# EAGLE design 8mu_pub (EAGLE 9.3.1)
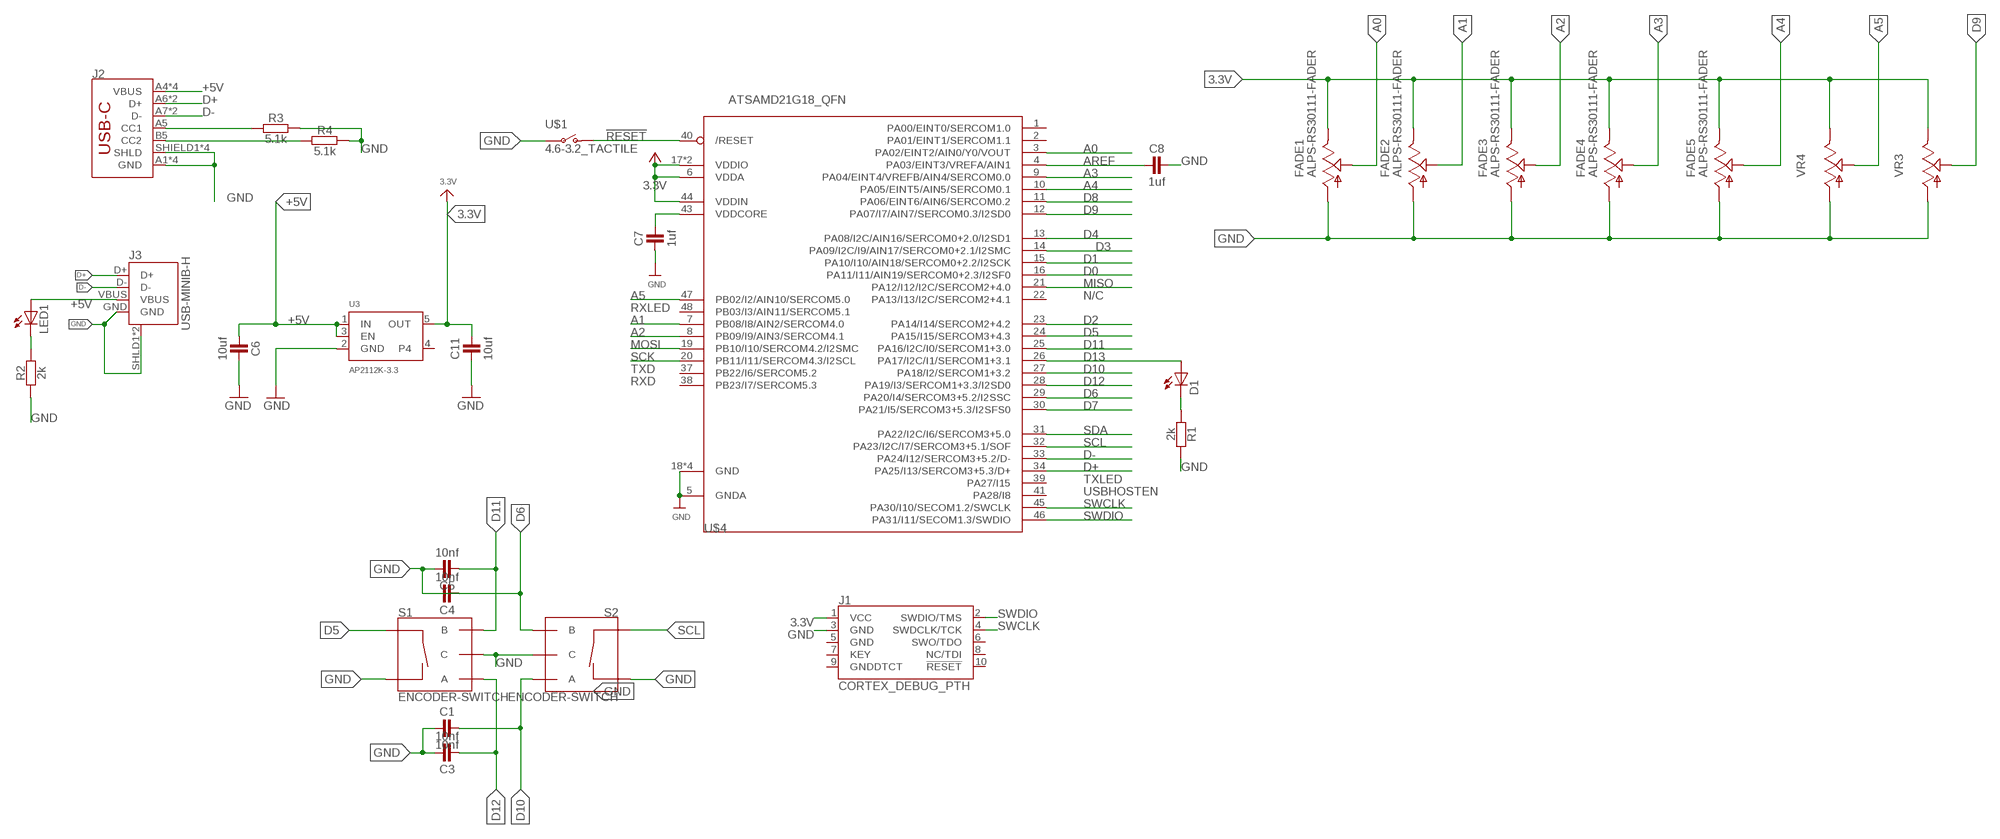
[diagram p0: schematic, sheet 1]

## Parts
C1  10nf  CAPACITOR-0603  [C0603]
C3  10nf  CAPACITOR-0603  [C0603]
C4  10nf  CAPACITOR-0603  [C0603]
C5  10nf  CAPACITOR-0603  [C0603]
C6  10uf  CAPACITOR-0603  [C0603]
C7  1uf  CAPACITOR-0603  [C0603]
C8  1uf  CAPACITOR-0603  [C0603]
C11  10uf  CAPACITOR-0603  [C0603]
D1  LED3MM  [LED3MM]
FADE1  ALPS-RS30111-FADER  [ALPS-RS30111-FADER]
FADE2  ALPS-RS30111-FADER  [ALPS-RS30111-FADER]
FADE3  ALPS-RS30111-FADER  [ALPS-RS30111-FADER]
FADE4  ALPS-RS30111-FADER  [ALPS-RS30111-FADER]
FADE5  ALPS-RS30111-FADER  [ALPS-RS30111-FADER]
J1  CORTEX_DEBUG_PTH  [2X5-PTH-1.27MM]
J2  USB_C  [CX90M-16P-USB-C-MIDMOUNT]
J3  USB-MINIB-H  [USB-MINIB-H]
LED1  LED3MM  [LED3MM]
R1  2k  RESISTOR-0603  [C0603]
R2  2k  RESISTOR-0603  [C0603]
R3  5.1k  RESISTOR-0603  [C0603]
R4  5.1k  RESISTOR-0603  [C0603]
S1  ENCODER-SWITCH  [ROTARY_ENC_PLAIN]
S2  ENCODER-SWITCH  [ROTARY_ENC_PLAIN]
U3  AP2112K-3.3  VREG_SOT23-5  [SOT23-5]
U$1  4.6-3.2_TACTILE  [TACTILE_SWITCH_SMD_4.6X2.8MM]
U$4  ATSAMD21G18_QFN  ATSAMD21J_QFN  [TQFN48_7MM]
VR3  9MM_SNAP-IN_POT_  [9MM_SNAP-IN_POT]
VR4  9MM_SNAP-IN_POT_  [9MM_SNAP-IN_POT]

## Nets
3.3V: C11.2 FADE1.3(E) FADE2.3(E) FADE3.3(E) FADE4.3(E) FADE5.3(E) J1.1(VCC) U3.5(OUT) U$4.6(VDDA) U$4.17(VDDIO) U$4.36(VDDIO) U$4.44(VDDIN) VR3.3(E) VR4.3(E) ; supply symbol labelled +3V3
!RESET: U$1.3(O) U$1.4(O) U$4.40(/RESET)
+5V: C6.1 J2.A4(VBUS) J2.A9(VBUS) J2.B4(VBUS) J2.B9(VBUS) J3.VBUS LED1.A U3.1(IN) U3.3(EN)
A0: FADE1.2(S) U$4.3(PA02/EINT2/AIN0/Y0/VOUT)
A1: FADE2.2(S) U$4.7(PB08/I8/AIN2/SERCOM4.0)
A2: FADE3.2(S) U$4.8(PB09/I9/AIN3/SERCOM4.1)
A3: FADE4.2(S) U$4.9(PA04/EINT4/VREFB/AIN4/SERCOM0.0)
A4: FADE5.2(S) U$4.10(PA05/EINT5/AIN5/SERCOM0.1)
A5: U$4.47(PB02/I2/AIN10/SERCOM5.0) VR4.2(S)
AREF: C8.1 U$4.4(PA03/EINT3/VREFA/AIN1)
D0: U$4.16(PA11/I11/AIN19/SERCOM0+2.3/I2SF0)
D1: U$4.15(PA10/I10/AIN18/SERCOM0+2.2/I2SCK)
D2: U$4.23(PA14/I14/SERCOM2+4.2)
D3: U$4.14(PA09/I2C/I9/AIN17/SERCOM0+2.1/I2SMC)
D4: U$4.13(PA08/I2C/AIN16/SERCOM0+2.0/I2SD1)
D5: S1.SW+ U$4.24(PA15/I15/SERCOM3+4.3)
D6: C4.2 S2.B U$4.29(PA20/I4/SERCOM3+5.2/I2SSC)
D7: U$4.30(PA21/I5/SERCOM3+5.3/I2SFS0)
D8: U$4.11(PA06/EINT6/AIN6/SERCOM0.2)
D9: U$4.12(PA07/I7/AIN7/SERCOM0.3/I2SD0) VR3.2(S)
D10: C1.2 S2.A U$4.27(PA18/I2/SERCOM1+3.2)
D11: C5.1 S1.B U$4.25(PA16/I2C/I0/SERCOM1+3.0)
D12: C3.1 S1.A U$4.28(PA19/I3/SERCOM1+3.3/I2SD0)
D13: D1.A U$4.26(PA17/I2C/I1/SERCOM1+3.1)
D+: J2.A6(D+) J2.B6(D+) J3.D+ U$4.34(PA25/I13/SERCOM3+5.3/D+)
D-: J2.A7(D-) J2.B7(D-) J3.D- U$4.33(PA24/I12/SERCOM3+5.2/D-)
GND: C1.1 C3.2 C4.1 C5.2 C6.2 C7.1 C8.2 C11.1 FADE1.1(A) FADE2.1(A) FADE3.1(A) FADE4.1(A) FADE5.1(A) J1.3(GND) J2.A1(GND) J2.A12(GND) J2.B1(GND) J2.B12(GND) J2.SHIELD1(SHLD) J2.SHIELD2(SHLD) J2.SHIELD3(SHLD) J2.SHIELD4(SHLD) J3.GND J3.SHLD1(SHIELD) J3.SHLD2(SHIELD) R1.2 R2.1 R3.2 R4.2 S1.C S1.SW- S2.C S2.SW- U3.2(GND) U$1.1(P) U$1.2(P) U$4.5(GNDA) U$4.18(GND) U$4.35(GND) U$4.42(GND) U$4.THERMAL(GND) VR3.1(A) VR4.1(A)
MISO: U$4.21(PA12/I12/I2C/SERCOM2+4.0)
MOSI: U$4.19(PB10/I10/SERCOM4.2/I2SMC)
N$1: D1.K(C) R1.1
N$2: LED1.K(C) R2.2
N$3: J2.A5(CC1) R3.1
N$4: J2.B5(CC2) R4.1
SCK: U$4.20(PB11/I11/SERCOM4.3/I2SCL)
SCL: S2.SW+ U$4.32(PA23/I2C/I7/SERCOM3+5.1/SOF)
SDA: U$4.31(PA22/I2C/I6/SERCOM3+5.0)
SWCLK: J1.4(SWDCLK/TCK) U$4.45(PA30/I10/SECOM1.2/SWCLK)
SWDIO: J1.2(SWDIO/TMS) U$4.46(PA31/I11/SECOM1.3/SWDIO)
VDDCORE: C7.2 U$4.43(VDDCORE)
Unconnected: J1.5(GND) J1.6(SWO/TDO) J1.7(KEY) J1.8(NC/TDI) J1.9(GNDDTCT) J1.10(!RESET) U3.4 U$4.1(PA00/EINT0/SERCOM1.0) U$4.2(PA01/EINT1/SERCOM1.1) U$4.22(PA13/I13/I2C/SERCOM2+4.1) U$4.37(PB22/I6/SERCOM5.2) U$4.38(PB23/I7/SERCOM5.3) U$4.39(PA27/I15) U$4.41(PA28/I8) U$4.48(PB03/I3/AIN11/SERCOM5.1)

## Notes on the sheet
- N/C
- RXLED
- TXD
- RXD
- TXLED
- USBHOSTEN

## Library data of the parts
C1 C3-C8 C11 = we-rcl:CAPACITOR: Capacitors ...2.2uF @ 6.3V -> 0402 ...4.7uF @ 6.3V -> 0603 ...10uF @ 16V -> 0805 ...22uF @ 25V -> 1206
D1 LED1 = TomW:LED: LED OSRAM: - CHIPLED LG R971, LG N971, LY N971, LG Q971, LY Q971, LO R971, LY R971 LH N974, LH R974 LS Q976, LO Q976, LY Q976 LO Q996 - Hyper CHIPLED LW Q18S LB Q993, LB Q99A, LB R99A - SideLED LS A670, LO A670, LY A670, LG A670, LP A670 LB A673, LV A673, LT A673, LW A673 LH A674 LY A675 LS A676, LA A676, LO A676, LY A676, LW A676 LS A679, LY A679, LG A679 - Hyper Micro SIDELED® LS Y876, LA Y876, LO Y876, LY Y876 LT Y87S - SmartLED LW L88C, LW L88S LB L89C, LB L89S, LG L890 LS L89K, LO L89K, LY L89K LS L896, LA L896, LO L896, LY L896 - TOPLED LS T670, LO T670, LY T670, LG T670, LP T670 LSG T670, LSP T670, LSY T670, LOP T670, LYG T670 LG T671, LOG T671, LSG T671 LB T673, LV T673, LT T673, LW T673 LH T674 LS T676, LA T676, LO T676, LY T676, LB T676, LH T676, LSB T676, LW T676 LB T67C, LV T67C, LT T67C, LS T67K, LO T67K, LY T67K, LW E67C LS E67B, LA E67B, LO E67B, LY E67B, LB E67C, LV E67C, LT E67C LW T67C LS T679, LY T679, LG T679 LS T770, LO T770, LY T770, LG T770, LP T770 LB T773, LV T773, LT T773, LW T773 LH T774 LS E675, LA E675, LY E675, LS T675 LS T776, LA T776, LO T776, LY T776, LB T776 LHGB T686 LT T68C, LB T68C - Hyper Mini TOPLED® LB M676 - Mini TOPLED Santana® LG M470 LS M47K, LO M47K, LY M47K Source: http://www.osram.convergy.de LUXEON: - LUMILED® LXK2-PW12-R00, LXK2-PW12-S00, LXK2-PW14-U00, LXK2-PW14-V00 LXK2-PM12-R00, LXK2-PM12-S00, LXK2-PM14-U00 LXK2-PE12-Q00, LXK2-PE12-R00, LXK2-PE12-S00, LXK2-PE14-T00, LXK2-PE14-U00 LXK2-PB12-K00, LXK2-PB12-L00, LXK2-PB12-M00, LXK2-PB14-N00, LXK2-PB14-P00, LXK2-PB14-Q00 LXK2-PR12-L00, LXK2-PR12-M00, LXK2-PR14-Q00, LXK2-PR14-R00 LXK2-PD12-Q00, LXK2-PD12-R00, LXK2-PD12-S00 LXK2-PH12-R00, LXK2-PH12-S00 LXK2-PL12-P00, LXK2-PL12-Q00, LXK2-PL12-R00 Source: www.luxeon.com KINGBRIGHT: KA-3528ASYC Source: www.kingbright.com
FADE1-FADE5 = MusicThingModular:ALPS-RS30111-FADER
J1 = SparkFun-Connectors:CORTEX_DEBUG: Cortex Debug Connector - 10 pin Supports JTAG debug, Serial Wire debug, and Serial Wire Viewer. PTH and SMD connector options available. General Connector Information <http://infocenter.arm.com/help/topic/com.arm.doc.faqs/attached/13634/cortex_debug_connectors.pdf> Products: PTH Connector <http://www.digikey.com/product-detail/en/cnc-tech/3220-10-0100-00/1175-1627-ND/3883661> -via Digi-Key SparkFun PSoc <https://www.sparkfun.com/products/13229> SparkFun T <https://www.sparkfun.com/products/13810>
J2 = MTM_untested:USB_C: USB Type C 16Pin Connector Super Speed pins not available on the 16-pin purely SMD connector so this part is best for USB 2.0 implementations. D1 and D2 are tied together enabling D+/- no matter which way the cable is plugged into the connector. The two channel configuration pins (CC1/2) are exposed. These are normally connected to ground via 5.1k resistors but can be reconfigured for high current/high power applications.
J3 = we-con:USB: USB Connectors
R1-R4 = we-rcl:RESISTOR: Resistors all kinds in 0402 and 0603
S1 S2 = SparkFun-Switches:ENCODER-SWITCH: Rotary Encoder w/ Select Switch Encoders rotate similarly to potentiometers, but they’re different from potentiometers in that an encoder has full rotation without limits. They output gray code so that you can tell how much and in which direction the encoder has been turned. This encoder includes a push-down select switch built into the shaft. SparkFun Products Rotary Encoder <https://www.sparkfun.com/products/9117> (COM-09117); SF_SKU: COM-09117
U3 = microbuilder:VREG_SOT23-5: SOT23-5 Fixed Voltage Regulators To better organise some of the SOT23-5 fixed voltage regulators in this library, this new part was created. Part Current Out V Out V In V Dropout Digikey Part No. ADP121 150mA 3.3V 3.4-5.5V 0.09V @ 150mA ADP121-AUJZ33R7CT-ND ADP121 150mA 3.0V 3.1-5.5V 0.09V @ 150mA ADP121-AUJZ30R7CT-ND ADP122 300mA 3.3V 3.4-5.5V 0.085V @ 300mA ADP122AUJZ-3.3-R7CT-ND ADP1712 300mA 3.3V 3.5-5.5V 0.17V @ 300mA ADP1712AUJZ-3.3-R7TR-ND AP7311 (Low Cost) 150mA 3.3V 3.5-6V 0.15V @ 150mA AP7311-33WG-7DICT-ND LD39015M18R 150mA 1.8V 1.9V-5.5V 0.08V @ 100mA 497-6977-1-ND MCP1824T-3302E/OT 300mA 3.3V 3.5V-6V 0.2V @ 300mA MCP1824T-3302E/OTCT-ND MIC5205-2.5YM5 TR 150mA 2.5V 2.7-16V 0.165V @ 150mA 576-1257-2-ND MIC5205-3.0YM5 TR 150mA 3.0V 3.2V-16V 0.165V @ 150mA 576-1258-2-ND MIC5205-3.3YM5 TR 150mA 3.3V 3.5V-16V 0.165V @ 150mA 576-1259-2-ND TPS780330220 150mA 3.3V+2.2V 3.6-5.5V 250mV Max 296-23332-1-ND TDA3663/N1,135 100mA 3.3V 3.5-45V 0.18V @ 50mA 568-5343-1-ND
U$1 = MTM_untested:4.6-3.2_TACTILE
U$4 = microbuilder:ATSAMD21J
VR3 VR4 = MusicThingModular:9MM_SNAP-IN_POT: 9mm vertical snap-in pot, Alpha / Panasonic style

## Net classes
3 pair: width 0.254 mm

## Board
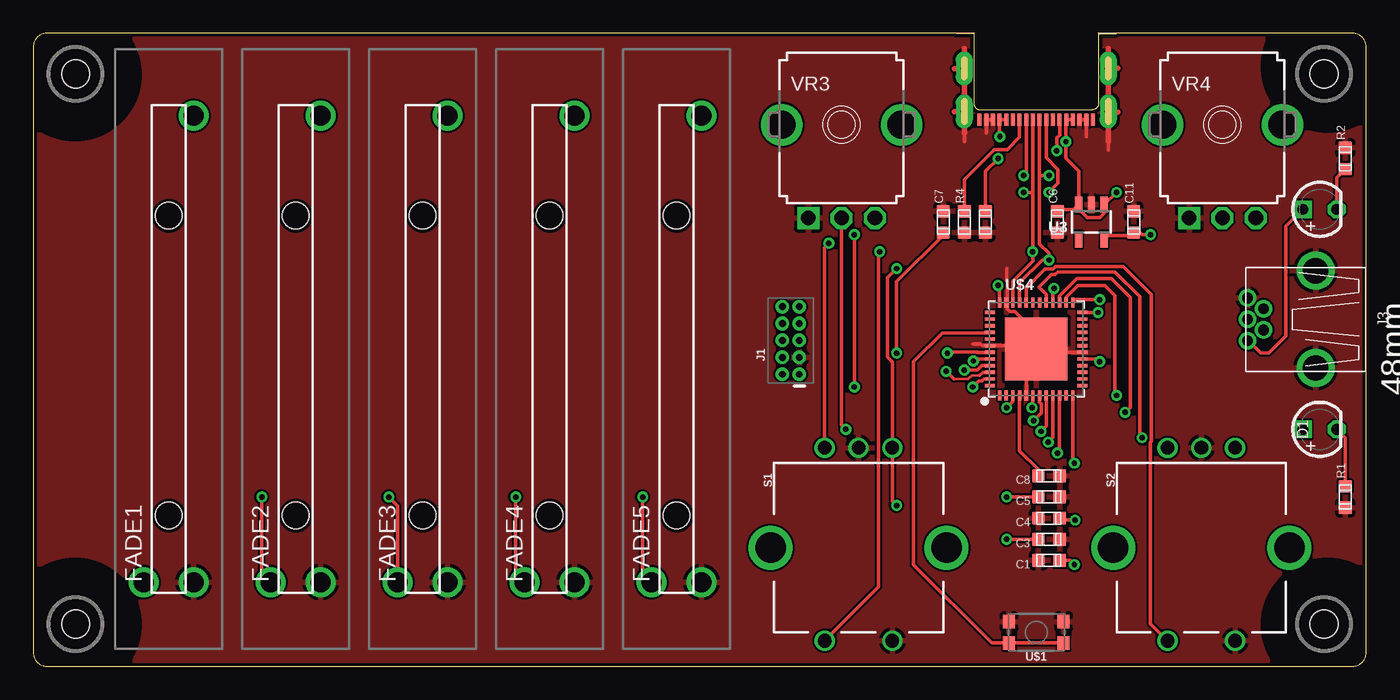
[diagram p1: board, top side]
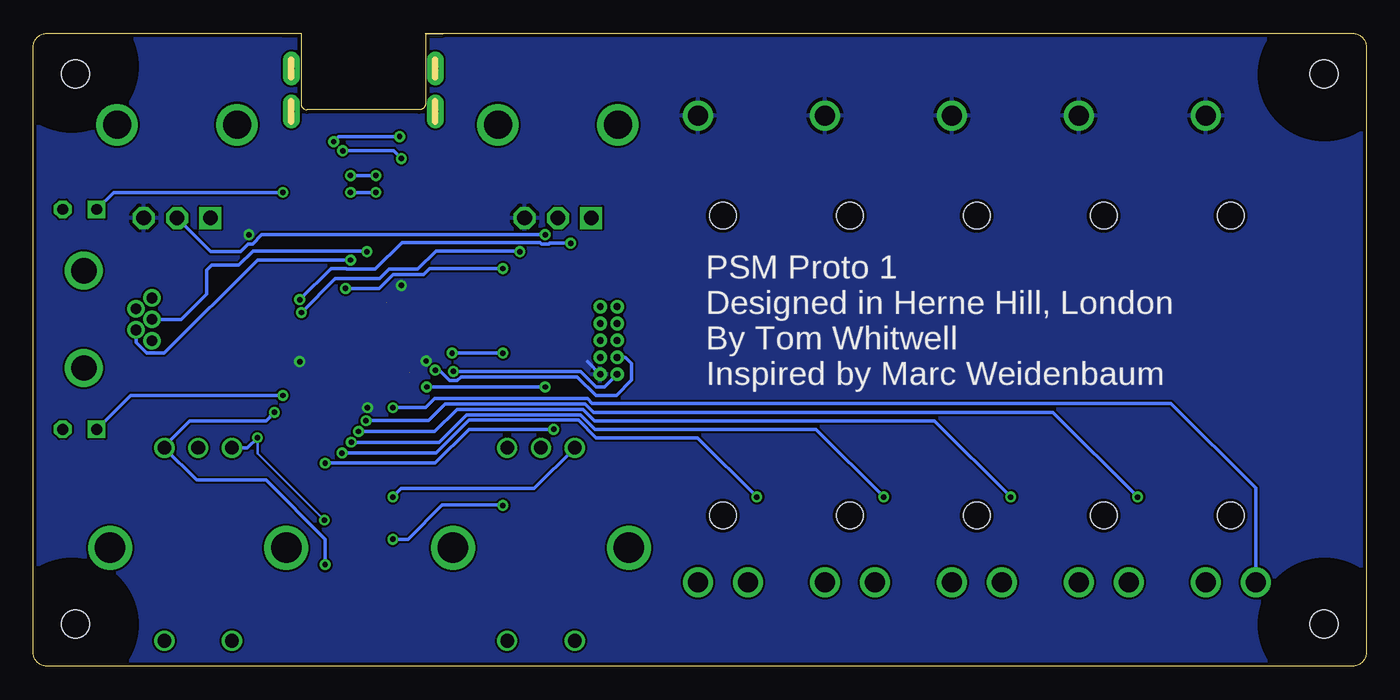
[diagram p2: board, bottom side, seen from below]

Size 100 x 47.5 mm. Coordinates in mm from the lower left corner, seen from the top.
Outline: 79.88,47.5 99,47.5 arc-90 100,46.5 100,1 arc-90 99,0 1,0 arc-90 0,1 0,46.5 arc-90 1,47.5 70.61,47.5
Copper layers (1*16): Top 0.035mm / dielectric 1.5mm / Bottom 0.035mm
Design rules "adafruit *": minimum track width 8mil, minimum drill 15.5mil, track to track 6mil, track to pad 6mil, pad to pad 6mil, via to via 6mil, smd to smd 6mil, copper to edge 10mil, drill to drill 8mil, minimum pad ring 10mil, minimum via ring 8mil, stop-mask expansion 2mil, vias tented up to drill 20mil, thermal gap 10mil
Holes 2.1 mm at 3.17,44.45 3.17,3.17 96.84,44.45 96.84,3.17
tRestrict: area -1.9,-1.9 to 8.1,8.1; area -1.9,39.4 to 8.1,49.4; area 92.1,40 to 102.1,50; area 92.1,-1.9 to 102.1,8.1
bRestrict: area -1.9,39.4 to 8.1,49.4; area -1.9,-1.9 to 8.1,8.1; area 92.1,40 to 102.1,50; area 92.1,-1.9 to 102.1,8.1

### Footprints (pad centres in the part's own frame; a part is rotated, then mirrored left to right if it is on the bottom)
C0603 = smd 1 x 0.95: 1 0,0.8; 2 0,-0.8
LED3MM = drill 0.813 square: A -1.27,0 | drill 0.813 octagon: K 1.27,0
ALPS-RS30111-FADER = drill 1.5: 1 -17.5,-1.875; 2 -17.5,1.875; 3 17.5,-1.875 | hole 2: -12.5,0; 10,0
2X5-PTH-1.27MM = drill 0.508 pad 1: 1 -2.54,-0.635; 2 -2.54,0.635; 3 -1.27,-0.635; 4 -1.27,0.635; 5 0,-0.635; 6 0,0.635; 7 1.27,-0.635; 8 1.27,0.635; 9 2.54,-0.635; 10 2.54,0.635
CX90M-16P-USB-C-MIDMOUNT = smd 0.3 x 0.9: A1 -3.75,3.85; A4 -2.75,3.85; A5 -1.75,3.85; A6 -0.75,3.85; A7 0.75,3.85; A8 1.75,3.85; A9 2.75,3.85; A12 3.75,3.85; B1 3.25,3.85; B4 2.25,3.85; B5 1.25,3.85; B6 0.25,3.85; B7 -0.25,3.85; B8 -1.25,3.85; B9 -2.25,3.85; B12 -3.25,3.85; MID1 -4.25,3.85; MID2 4.25,3.85 | drill 0.5 pad 1.27 long: SHIELD1 -5.4,0; SHIELD2 5.4,0; SHIELD3 -5.4,3.23; SHIELD4 5.4,3.23
USB-MINIB-H = drill 0.8 pad 1.25: D+ -5.1,0; D- -3.9,-0.8; GND -5.1,1.6; ID -3.9,0.8; VBUS -5.1,-1.6 | drill 1.9: SHLD1 0,-3.65; SHLD2 0,3.65
ROTARY_ENC_PLAIN = drill 1.016: A 7.493,-2.54; B 7.493,2.54; C 7.493,0; SW+ -6.985,2.54; SW- -6.985,-2.54 | drill 2.286: P$3 0,6.604; P$4 0,-6.604
SOT23-5 = smd 0.55 x 1.2: 1 -0.95,-1.3; 2 0,-1.3; 3 0.95,-1.3; 4 0.95,1.3; 5 -0.95,1.3
TACTILE_SWITCH_SMD_4.6X2.8MM = smd 0.9 x 1: 1 -2.05,-0.8; 2 2.05,-0.8; 3 2.05,0.8; 4 -2.05,0.8
TQFN48_7MM = smd 0.25 x 0.75: 1 -2.75,-3.475; 2 -2.25,-3.475; 3 -1.75,-3.475; 4 -1.25,-3.475; 5 -0.75,-3.475; 6 -0.25,-3.475; 7 0.25,-3.475; 8 0.75,-3.475; 9 1.25,-3.475; 10 1.75,-3.475; 11 2.25,-3.475; 12 2.75,-3.475; 25 2.75,3.475; 26 2.25,3.475; 27 1.75,3.475; 28 1.25,3.475; 29 0.75,3.475; 30 0.25,3.475; 31 -0.25,3.475; 32 -0.75,3.475; 33 -1.25,3.475; 34 -1.75,3.475; 35 -2.25,3.475; 36 -2.75,3.475 | smd 0.75 x 0.25: 13 3.475,-2.75; 14 3.475,-2.25; 15 3.475,-1.75; 16 3.475,-1.25; 17 3.475,-0.75; 18 3.475,-0.25; 19 3.475,0.25; 20 3.475,0.75; 21 3.475,1.25; 22 3.475,1.75; 23 3.475,2.25; 24 3.475,2.75; 37 -3.475,2.75; 38 -3.475,2.25; 39 -3.475,1.75; 40 -3.475,1.25; 41 -3.475,0.75; 42 -3.475,0.25; 43 -3.475,-0.25; 44 -3.475,-0.75; 45 -3.475,-1.25; 46 -3.475,-1.75; 47 -3.475,-2.25; 48 -3.475,-2.75 | smd 4.7 x 4.7: THERMAL 0,0
9MM_SNAP-IN_POT = drill 1.1 square: 1 -2.5,-7 | drill 1.1 octagon: 2 0,-7; 3 2.5,-7 | drill 2.1 pad 2.794: CHASSIS1 -4.5,0; CHASSIS2 4.5,0

### Placement (x,y rotation side)
C1  76.2,7.94 90 top
C3  76.2,9.53 90 top
C4  76.2,11.11 90 top
C5  76.2,12.7 90 top
C6  76.83,33.34 0 top
C7  68.26,33.34 0 top
C8  76.2,14.29 90 top
C11  82.55,33.34 0 top
D1  96.52,17.78 0 top
FADE1  10.16,23.81 90 top
FADE2  19.68,23.81 90 top
FADE3  29.21,23.81 90 top
FADE4  38.73,23.81 90 top
FADE5  48.26,23.81 90 top
J1  56.83,24.45 90 top
J2  75.25,44.87 180 top
J3  96.2,26.04 0 top
LED1  96.52,34.29 0 top
R1  98.42,12.7 0 top
R2  98.42,38.1 0 top
R3  71.44,33.34 0 top
R4  69.85,33.34 0 top
S1  61.91,8.89 90 top
S2  87.63,8.89 90 top
U3  79.38,33.34 180 top
U$1  75.25,2.54 180 top
U$4  75.25,23.81 0 top
VR3  60.64,40.64 0 top
VR4  89.22,40.64 0 top

### Tracks (layer width: path | path; a pad name or v marks a point on that pad's centre or on a via)
3.3V  (via drill 0.41)
  Top 0.254: U3.5 80.6,32.32 82.33,32.32 C11.2 83.03,32.54 83.19,32.38 v83.82,32.38 | U$4.36 72.5,28.47 v72.39,28.57 | U$4.17 79.81,23.06 v80.01,22.86 | U$4.6 75.01,19.47 v74.93,19.4 | U$4.44 70.69,23.06 v70.53,22.91
  Bottom 0.254: J1.1 58.42,22.86
  pour Bottom: -1.59,52.39 103.19,52.39 103.19,-1.59 -1.59,-1.59
!RESET
  Top 0.254: U$1.4 U$1.3 71.92,1.74 66.04,7.62 66.04,22.86 68.2,25.02 71.73,25.02 U$4.40
+5V  (via drill 0.41)
  Top 0.254: J2.A4 J2.B9 77.47,40.89 v77.47,39.37 77.47,38.98 77.47,38.97 77.47,38.12 78.44,37.16 78.42,37.15 U3.3 | J2.B4 J2.A9 72.5,39.77 v72.52,39.75 | U3.3 78.44,34.62 78.44,34.3 79.09,33.66 80.01,33.66 80.33,33.97 U3.1 81.25,35.56 v81.28,35.56 | C6.1 76.95,34.26 78.04,34.26 U3.3 | J3.VBUS 91.14,24.43 92.08,23.5 92.71,23.5 93.98,24.77 93.98,33.02 LED1.A
  Bottom 0.254: v72.52,39.75 77.09,39.75 v77.47,39.37 | v81.28,35.56 93.98,35.56 LED1.A
A0  (via drill 0.41)
  Top 0.254: U$4.3 73.5,19.88 v73.03,19.4
  Bottom 0.254: v73.03,19.4 70.59,19.4 69.9,20.09 58.43,20.09 58.07,19.73 48.85,19.73 48.84,19.74 14.66,19.74 8.29,13.37 FADE1.2
A1  (via drill 0.41)
  Top 0.254: v17.14,12.7 17.14,6.98 FADE2.2 | U$4.7 75.5,19.8 75.62,19.68 75.62,19 v75.04,18.43
  Bottom 0.254: v75.04,18.43 70.35,18.43 69.09,19.68 58.6,19.68 57.97,19.05 23.5,19.05 v17.14,12.7
A2  (via drill 0.41)
  Top 0.254: v26.67,12.7 27.34,12.04 FADE3.2 | U$4.8 76,19.87 76.02,19.85 76.02,18.05 v75.6,17.62
  Bottom 0.254: v75.6,17.62 69.88,17.62 68.22,19.28 58.77,19.28 57.91,18.41 32.38,18.41 v26.67,12.7
A3  (via drill 0.41)
  Top 0.254: U$4.9 76.5,17.16 v76.15,16.81 | v36.2,12.7 36.2,6.98 FADE4.2
  Bottom 0.254: v36.2,12.7 41.27,17.78 57.84,17.78 58.94,18.87 67.49,18.87 69.55,16.81 v76.15,16.81
A4  (via drill 0.41)
  Top 0.254: U$4.10 77,16 v76.83,16 | v45.72,12.7 45.72,6.98 FADE5.2
  Bottom 0.254: v76.83,16 69.79,16 67.32,18.47 59.11,18.47 57.78,17.14 50.16,17.14 v45.72,12.7
A5  (via drill 0.41)
  Top 0.254: U$4.47 71.31,21.56 71.15,21.41 70.94,21.41 v70.48,20.95 | v61.59,20.95 v61.59,32.38
  Bottom 0.254: v70.48,20.95 v61.59,20.95 | v61.59,32.38 82.85,32.38 83.54,31.7 83.87,31.7 84.45,31.11 86.69,31.11 VR4.2
AREF
  Top 0.254: U$4.4 74,16.17 75.4,14.77 C8.1
D5  (via drill 0.41)
  Top 0.254: v63.5,31.11 63.41,31.03 63.41,5.94 S1.SW+ | v79.88,26.54 79.86,26.56 U$4.24
  Bottom 0.254: v63.5,31.11 63.55,31.17 69.8,31.17 71.17,29.79 73.31,29.79 74.02,29.08 77.34,29.08 v79.88,26.54
D6  (via drill 0.39, 0.41)
  Top 0.203: 77.14,10.97 C4.2 | 78.11,10.97 v78.17,10.97
  Top 0.254: U$4.29 76,27.89 75.44,28.45 76.38,29.39 76.65,29.39 76.86,29.59 81.15,29.59 83.01,27.74 83.01,17.32 v83.19,17.14 | 77.14,10.97 78.11,10.97
  Bottom 0.203: v78.17,10.97 83.19,15.98 v83.19,17.14
  Bottom 0.254: v83.19,17.14 83.95,16.38 S2.B
D9  (via drill 0.41)
  Top 0.254: VR3.2 60.64,18.1 v60.96,17.78 | v78.11,15.24 78,15.35 U$4.12
  Bottom 0.254: v78.11,15.24 69.85,15.24 67.31,17.78 v60.96,17.78
D10  (via drill 0.41)
  Top 0.254: C1.2 77.79,7.94 v78.11,7.62 | U$4.27 77,27.8 78.29,29.08 80.9,29.08 82.3,27.69 82.3,19.43 v81.92,19.05
  Bottom 0.254: v78.11,7.62 78.11,9.53 82.55,13.97 87.76,13.97 S2.A 90.17,16.51 88.27,18.41 82.55,18.41 v81.92,19.05
D11  (via drill 0.41)
  Top 0.254: U$4.25 78.22,27.51 v80.01,27.51 | v59.69,31.75 59.37,31.43 S1.B | v73.03,12.7 C5.1
  Bottom 0.254: S1.B 62.42,13.34 72.39,13.34 v73.03,12.7 | v80.01,27.51 77.67,29.84 76.53,29.84 76.48,29.79 74.35,29.79 72.34,31.8 61.98,31.8 61.88,31.7 61.31,31.7 61.26,31.75 v59.69,31.75
D12  (via drill 0.41)
  Top 0.254: v64.77,12.06 64.45,12.38 S1.A 64.45,22.84 64.08,23.21 64.08,29.16 v64.77,29.84 | v73.03,9.53 C3.1 | v76.58,28.35 76.5,28.27 U$4.28
  Bottom 0.254: v73.03,9.53 71.88,9.53 69.32,12.09 64.8,12.09 v64.77,12.06 | v64.77,29.84 70.26,29.84 70.72,29.39 73,29.39 74.04,28.35 v76.58,28.35
D13  (via drill 0.41)
  Top 0.254: U$4.26 77.5,27.72 78.35,28.57 80.39,28.57 81.15,27.81 81.15,20.32 v81.28,20.32
  Bottom 0.254: v81.28,20.32 92.71,20.32 D1.A
D+  (via drill 0.41)  (1 unrouted)
  Top 0.254: J2.B6 75.01,40.91 75.01,35.56 74.98,35.56 | 74.98,35.56 v74.98,31.11 74.98,30.4 73.5,28.92 73.5,27.36 U$4.34 | J2.A6 76,38.17 76.89,37.29 76.89,36.25 v76.2,35.56 | v74.3,35.56 74.98,35.56
  Bottom 0.254: v76.2,35.56 v74.3,35.56 | J3.D+ 88.9,26.04 87,27.94 87,29.72 86.61,30.1 84.58,30.1 83.52,31.17 75.03,31.17 v74.98,31.11
D-  (via drill 0.41)
  Top 0.254: J2.B7 75.5,36.83 | 75.5,36.83 75.5,31.7 76.2,30.99 v76.2,30.48 75.69,30.48 74,28.79 U$4.33 | v74.3,36.83 74.3,36.84 74.5,37.05 74.5,40.91 J2.A7 | v76.2,36.83 75.5,36.83
  Bottom 0.254: J3.D- 92.29,24.3 91.49,23.5 90.16,23.5 83.19,30.48 v76.2,30.48 | v74.3,36.83 v76.2,36.83
GND
  Top 0.254: 78.99,39.75 79,39.76 J2.A1 J2.B12 | 71.5,40.01 J2.A12 J2.B1 | 73.03,29.84 73.03,28.91 73.08,28.86 73.08,27.37 U$4.35 73.09,27.19 73.09,26.8 73.26,26.63 73.65,26.63 74.93,25.36 74.93,23.5 | 70.48,24.18 71.07,24.18 71.19,24.06 U$4.42 74.36,24.06 74.93,23.5 | U$4.5 74.5,23.06 74.93,23.5 | 74.93,23.5 U$4.THERMAL 75.5,23.56 U$4.18 | J2.SHIELD2 J2.SHIELD4 69.85,41.53 69.85,40.01 69.85,39.37 | J2.SHIELD1 J2.SHIELD3 80.64,41.53 80.64,39.37 80.64,38.73
  Top 0.406: 80.64,46.35 80.64,39.37 | 69.85,46.35 69.85,40.01
  pour Top: -3.17,49.21 -3.17,-1.59 104.78,-1.59 104.78,49.21
N$1
  Top 0.254: R1.1 98.42,17.14 D1.K
N$2
  Top 0.254: LED1.K 97.79,36.66 R2.2
N$3  (via drill 0.41)
  Top 0.254: v76.79,38.69 76.79,39.08 76.78,39.09 76.78,39.65 77,39.87 77,40.91 J2.A5 | v72.39,38.1 71.44,37.15 R3.1
  Bottom 0.254: v76.79,38.69 72.98,38.69 v72.39,38.1
N$4
  Top 0.254: R4.1 69.85,36.53 72.11,38.79 73.08,38.79 74,39.71 J2.B5
N$5
  Top 0.406: 81.36,41.58 80.67,41.58
N$6
  Top 0.406: 81.36,44.88 80.7,44.88
N$7
  Top 0.406: 69.11,41.6 70,41.6
N$8
  Top 0.406: 69.11,44.86 70.03,44.86
SCL
  Top 0.254: S2.SW+ 83.82,3.17 83.82,16.81 83.87,16.86 83.87,27.89 81.76,30 76.69,30 76.48,29.79 75.89,29.79 74.5,28.4 U$4.32
SWCLK  (via drill 0.41)
  Top 0.254: U$4.45 71.16,22.57 70.82,22.22 70.25,22.22 70.25,22.23 v69.85,22.23
  Bottom 0.254: J1.4 55.56,23.18 55.12,22.73 55.12,21.46 56.26,20.32 57.78,20.32 59.19,21.72 67.92,21.72 68.2,21.44 68.77,21.44 69.55,22.23 v69.85,22.23
SWDIO  (via drill 0.41)  (1 unrouted)
  Top 0.203: 69.08,21.54 70.13,21.54 70.41,21.82 70.98,21.82
  Top 0.254: 69.08,21.54 v68.48,22.13 | U$4.46 71.23,22.06 70.98,21.82
  Bottom 0.254: v68.48,22.13 58.96,22.13 57.78,20.95 57.15,20.95 J1.2
VDDCORE  (via drill 0.41)
  Top 0.254: C7.2 68.26,32.37 64.77,28.88 v64.77,23.5 | U$4.43 70.85,23.56 70.82,23.59 68.68,23.59 v68.58,23.5
  Bottom 0.254: v64.77,23.5 v68.58,23.5

### Text on the board
tPlace: 100mm | 48mm
bPlace: PSM Proto 1 / Designed in Herne Hill, London / By Tom Whitwell / Inspired by Marc Weidenbaum